# Altium schematic sheet robot_lfy.SchDoc
size A2
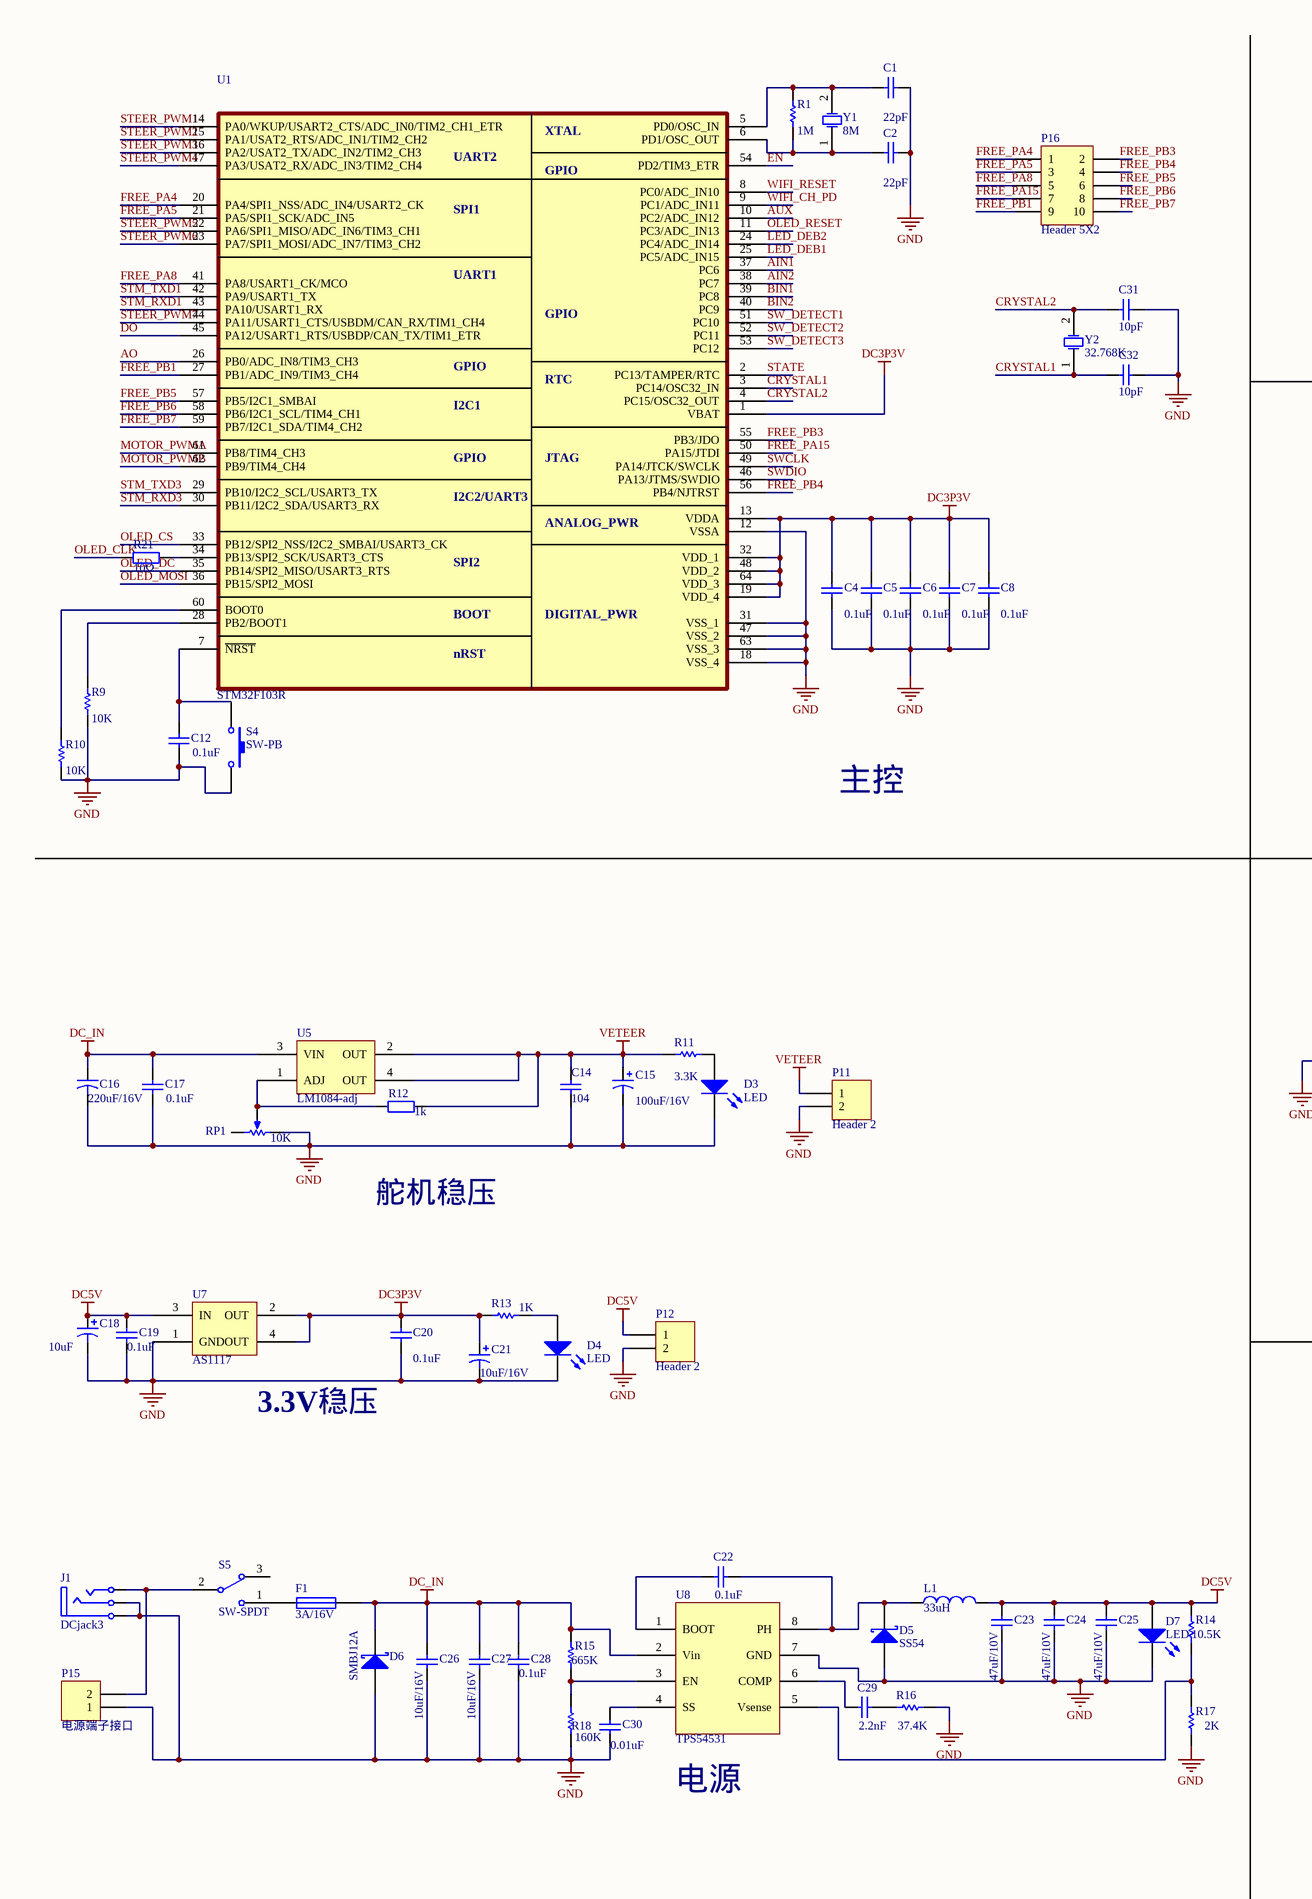
[diagram p0: robot_lfy.SchDoc, left]
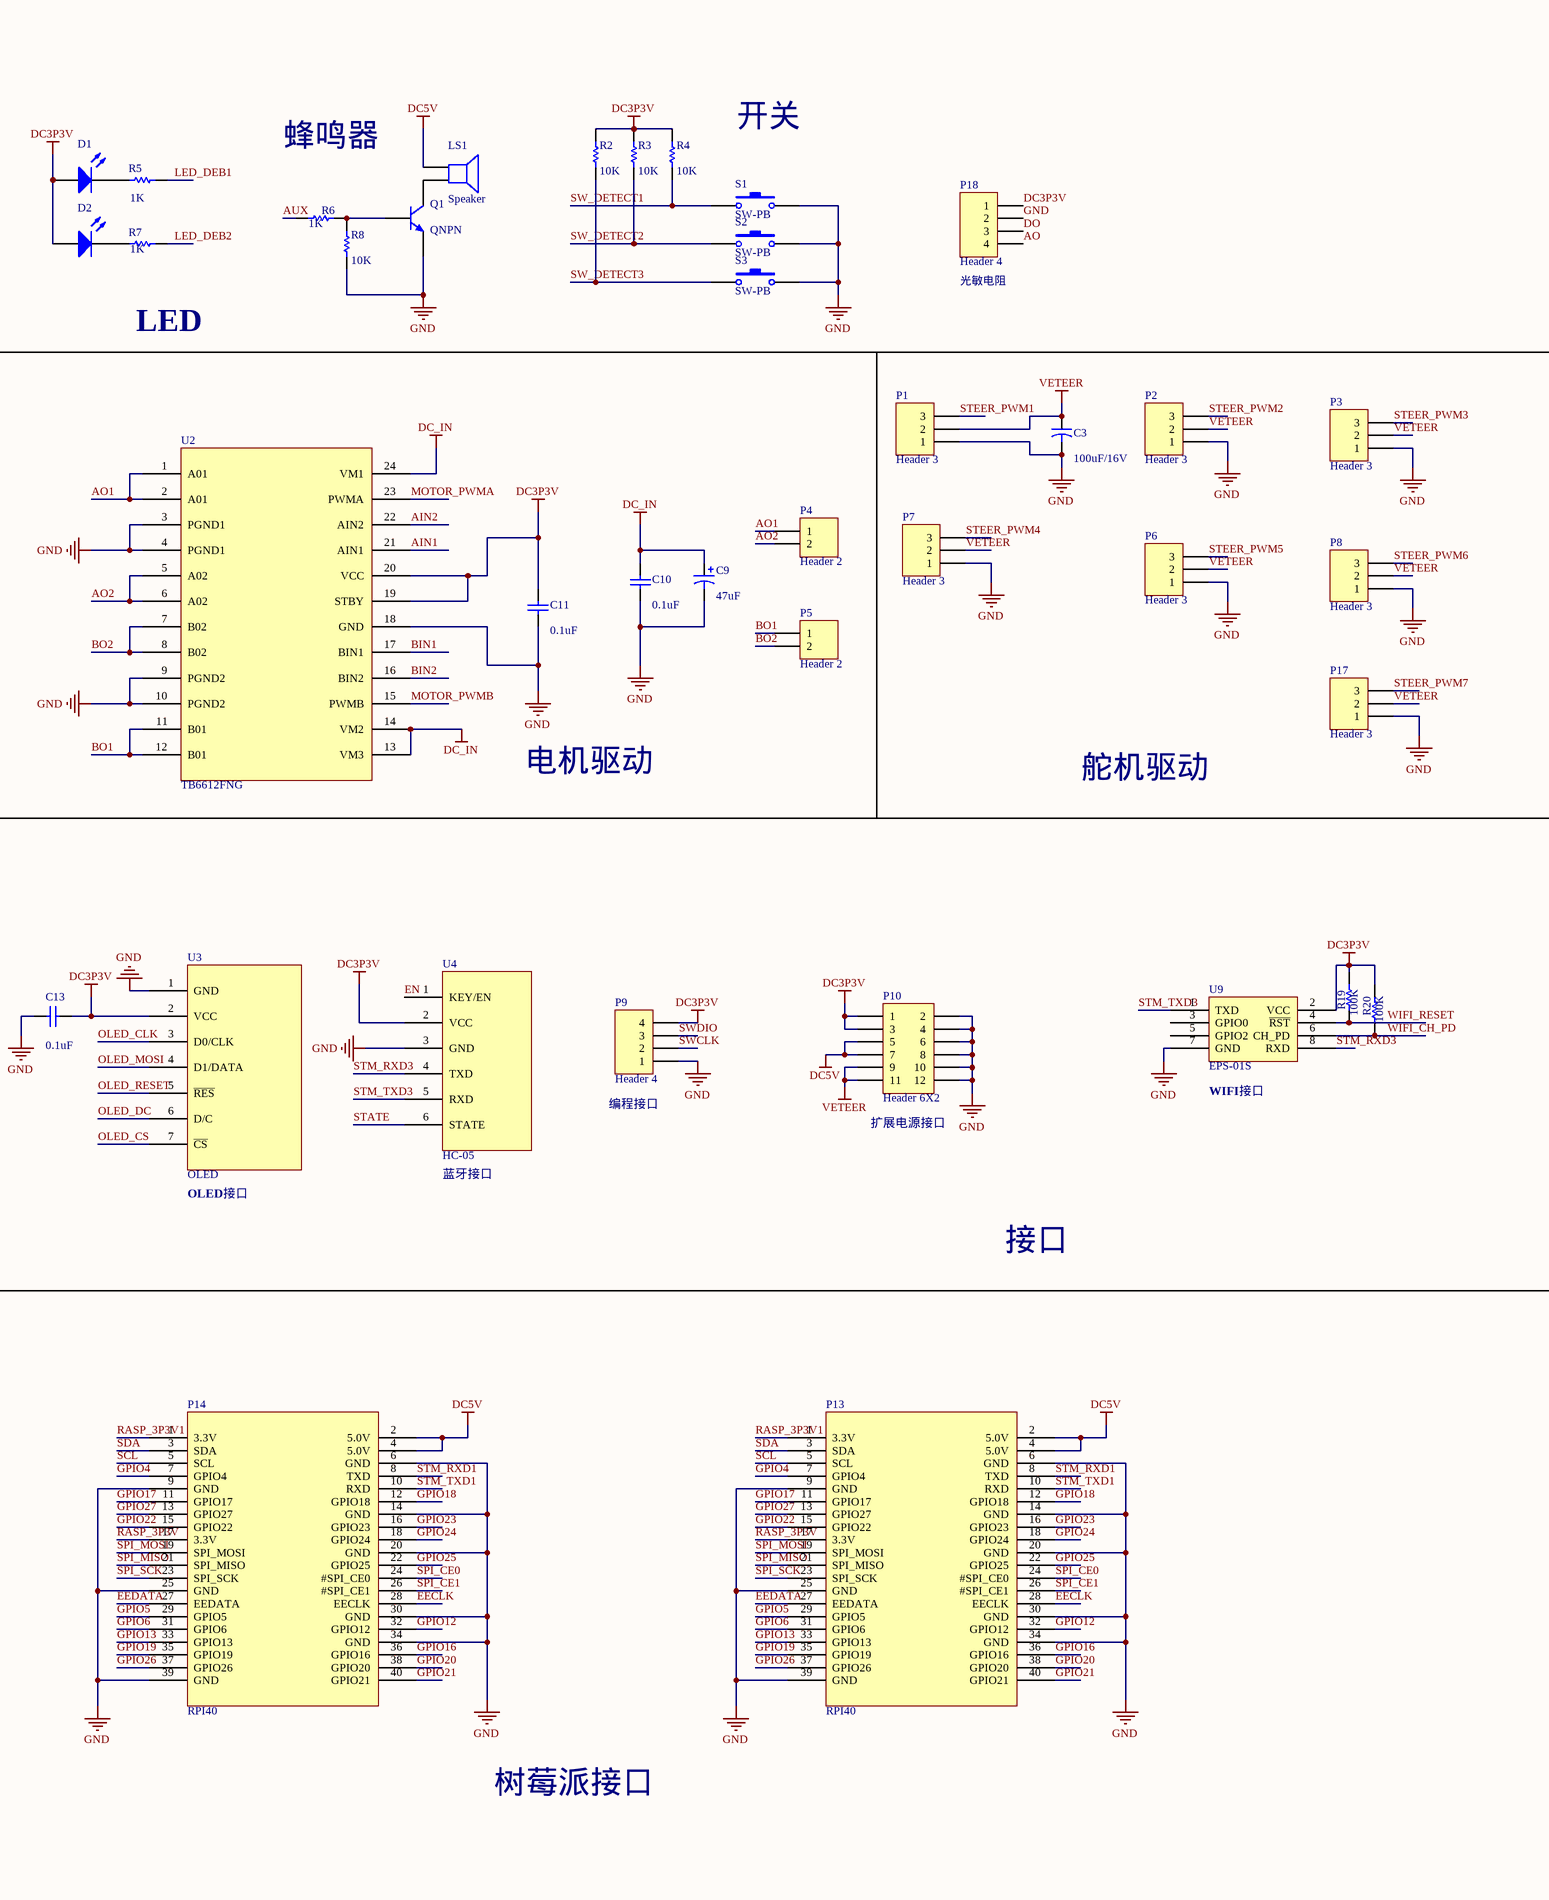
[diagram p1: robot_lfy.SchDoc, right]

## Parts
C1  value 22pF  [LC-0805_C]
C2  value 22pF  [LC-0805_C]
C3  value 100uF/16V  [CM D(6.3*7.7)]
C4  value 0.1uF  [LC-0805_C]
C5  value 0.1uF  [LC-0805_C]
C6  value 0.1uF  [LC-0805_C]
C7  value 0.1uF  [LC-0805_C]
C8  value 0.1uF  [LC-0805_C]
C9  value 47uF  [LC-1206_C]
C10  value 0.1uF  [LC-0805_C]
C11  value 0.1uF  [LC-0805_C]
C12  value 0.1uF  [LC-0805_C]
C13  value 0.1uF  [LC-0805_C]
C14  value 104  [LC-0805_C]
C15  value 100uF/16V  [CM D(6.3*7.7)]
C16  value 220uF/16V  [CM D(6.3*7.7)]
C17  value 0.1uF  [LC-0805_C]
C18  value 10uF  [LC-1206_C]
C19  value 0.1uF  [LC-0805_C]
C20  value 0.1uF  [LC-0805_C]
C21  value 10uF/16V  [LC-1206_C]
C22  value 0.1uF  [LC-0805_C]
C23  value 47uF/10V  [LC-1206_C]
C24  value 47uF/10V  [LC-1206_C]
C25  value 47uF/10V  [LC-1206_C]
C26  value 10uF/16V  [LC-0805_C]
C27  value 10uF/16V  [LC-0805_C]
C28  value 0.1uF  [LC-0805_C]
C29  value 2.2nF  [LC-0805_C]
C30  value 0.01uF  [LC-0805_C]
C31  value 10pF  [LC-0805_C]  (hidden comment: Cap)
C32  value 10pF  [LC-0805_C]  (hidden comment: Cap)
D1  (no value)  [LFY-0805_LED_S1]
D2  (no value)  [LFY-0805_LED_S1]
D3  LED  [LFY-0805_LED_S1]
D4  LED  [LFY-0805_LED_S1]
D5  SS54  [LFY-SMA(DO-214AC)S2]
D6  SMBJ12A  [LFY-SMA(DO-214AC)S2]
D7  LED  [LFY-0805_LED_S1]
F1  3A/16V  [LFY-1812_F]
J1  DCjack3  [HDC12]
L1  value 33uH  [LFY-SLO1040H]
LS1  Speaker  [BZ]
P1  Header 3  [HDR1X3]
P2  Header 3  [HDR1X3]
P3  Header 3  [HDR1X3]
P4  Header 2  [KF508-2P]
P5  Header 2  [KF508-2P]
P6  Header 3  [HDR1X3]
P7  Header 3  [HDR1X3]
P8  Header 3  [HDR1X3]
P9  Header 4  [HDR1X4]
P10  Header 6X2  [HDR2X6]
P11  Header 2  [KF508-2P]
P12  Header 2  [KF508-2P]
P13  RPI40  [HDR2X20]
P14  RPI40  [HDR2X20]
P15  电源端子接口  [KF508-2P]
P16  Header 5X2  [HDR2X5]
P17  Header 3  [HDR1X3]
P18  Header 4  [HDR1X4]
Q1  QNPN  [SOT-23B]
R1  value 1M  [LC-0805_R]
R2  value 10K  [LC-0805_R]
R3  value 10K  [LC-0805_R]
R4  value 10K  [LC-0805_R]
R5  value 1K  [LC-0805_R]
R6  value 1K  [LC-0805_R]
R7  value 1K  [LC-0805_R]
R8  value 10K  [LC-0805_R]
R9  value 10K  [LC-0805_R]
R10  value 10K  [LC-0805_R]
R11  value 3.3K  [LC-0805_R]
R12  value 1k  [LC-0805_R]
R13  value 1K  [LC-0805_R]
R14  value 10.5K  [LC-0805_R]
R15  value 665K  [LC-0805_R]
R16  value 37.4K  [LC-0805_R]
R17  value 2K  [LC-0805_R]
R18  value 160K  [LC-0805_R]
R19  value 100K  [LC-0805_R]
R20  value 100K  [LC-0805_R]
R21  value 10Ω  [LC-0805_R]  (hidden comment: Res2)
RP1  10K  [LFT-VR-3296]
S1  SW-PB  [SW-PB2]
S2  SW-PB  [SW-PB2]
S3  SW-PB  [SW-PB2]
S4  SW-PB  [SW-PB2]
S5  SW-SPDT  [LFY-SW-153D6-5]
U1  STM32F103R  [LFY-LQFP64-10*10]
U2  TB6612FNG  [LFY-SSOP24]
U3  OLED  [HDR1X7]
U4  HC-05
U5  LM1084-adj  [LFY-TO263-3]
U7  AS1117  [LFY-SOT223]
U8  TPS54531  [LFY-PDSO8]
U9  EPS-01S  [HDR2X4]
Y1  8M  [LC-HC-49S]
Y2  32.768K  [LFY-XTAL-8M]

## Nets
DC3P3V: C4.2 C5.2 C6.2 C7.2 C8.2 C11.2 C13.2 C20.2 C21.1 D1.1(A) D2.1(A) P9.4 P10.1 P10.3 P18.1 R2.2 R3.2 R4.2 R13.1 R19.1 R20.1 U1.1(VBAT) U1.13(VDDA) U1.19(VDD_4) U1.32(VDD_1) U1.48(VDD_2) U1.64(VDD_3) U2.19(STBY) U2.20(VCC) U3.2(VCC) U4.2(VCC) U7.2(OUT) U7.4(OUT) U9.2(VCC)
DC5V: C18.1 C19.2 C23.1 C24.1 C25.1 D7.1(A) L1.2 LS1.1 P10.5 P10.7 P12.1 P13.2(5.0V) P13.4(5.0V) P14.2(5.0V) P14.4(5.0V) R14.2 U7.3(IN)
DC_IN: C9.1 C10.2 C16.1 C17.2 C26.2 C27.2 C28.2 D6.2(K) F1.2 R15.2 U2.13(VM3) U2.14(VM2) U2.24(VM1) U5.3(VIN) U8.2(Vin)
GND: C1.2 C2.2 C3.2 C4.1 C5.1 C6.1 C7.1 C8.1 C9.2 C10.1 C11.1 C12.1 C13.1 C14.1 C15.2 C16.2 C17.1 C18.2 C19.1 C20.1 C21.2 C23.2 C24.2 C25.2 C26.1 C27.1 C28.1 C30.1 C31.1 C32.1 D3.2(K) D4.2(K) D5.1(A) D6.1(A) D7.2(K) J1.2(R) J1.3(S) P1.1 P2.1 P3.1 P6.1 P7.1 P8.1 P9.1 P10.2 P10.4 P10.6 P10.8 P10.10 P10.12 P11.2 P12.2 P13.6(GND) P13.9(GND) P13.14(GND) P13.20(GND) P13.25(GND) P13.30(GND) P13.34(GND) P13.39(GND) P14.6(GND) P14.9(GND) P14.14(GND) P14.20(GND) P14.25(GND) P14.30(GND) P14.34(GND) P14.39(GND) P15.1 P17.1 P18.2 Q1.2(E) R8.1 R9.1 R10.1 R16.1 R17.1 R18.1 RP1.1(TOP) S1.2 S2.2 S3.2 S4.2 U1.12(VSSA) U1.18(VSS_4) U1.31(VSS_1) U1.47(VSS_2) U1.63(VSS_3) U2.3(PGND1) U2.4(PGND1) U2.9(PGND2) U2.10(PGND2) U2.18(GND) U3.1(GND) U4.3(GND) U7.1(GND) U8.7(GND) U9.7(GND)
VETEER: C3.1 C14.2 C15.1 P1.2 P2.2 P3.2 P6.2 P7.2 P8.2 P10.9 P10.11 P11.1 P17.2 R11.1 R12.1 U5.2(OUT) U5.4(OUT)
AIN1: U1.37(PC6) U2.21(AIN1)
AIN2: U1.38(PC7) U2.22(AIN2)
AO: P18.4 U1.26(PB0/ADC_IN8/TIM3_CH3)
AO1: P4.1 U2.1(A01) U2.2(A01)
AO2: P4.2 U2.5(A02) U2.6(A02)
AUX: R6.1 U1.10(PC2/ADC_IN12)
BIN1: U1.39(PC8) U2.17(BIN1)
BIN2: U1.40(PC9) U2.16(BIN2)
BO1: P5.1 U2.11(B01) U2.12(B01)
BO2: P5.2 U2.7(B02) U2.8(B02)
CRYSTAL1: C32.2 U1.3(PC14/OSC32_IN) Y2.1(OSC1)
CRYSTAL2: C31.2 U1.4(PC15/OSC32_OUT) Y2.2(OSC2)
DO: P18.3 U1.45(PA12/USART1_RTS/USBDP/CAN_TX/TIM1_ETR)
EECLK: P13.28(EECLK) P14.28(EECLK)
EEDATA: P13.27(EEDATA) P14.27(EEDATA)
EN: U1.54(PD2/TIM3_ETR) U4.1(KEY/EN)
FREE_PA4: P16.1 U1.20(PA4/SPI1_NSS/ADC_IN4/USART2_CK)
FREE_PA5: P16.3 U1.21(PA5/SPI1_SCK/ADC_IN5)
FREE_PA8: P16.5 U1.41(PA8/USART1_CK/MCO)
FREE_PA15: P16.7 U1.50(PA15/JTDI)
FREE_PB1: P16.9 U1.27(PB1/ADC_IN9/TIM3_CH4)
FREE_PB3: P16.2 U1.55(PB3/JDO)
FREE_PB4: P16.4 U1.56(PB4/NJTRST)
FREE_PB5: P16.6 U1.57(PB5/I2C1_SMBAI)
FREE_PB6: P16.8 U1.58(PB6/I2C1_SCL/TIM4_CH1)
FREE_PB7: P16.10 U1.59(PB7/I2C1_SDA/TIM4_CH2)
GPIO4: P13.7(GPIO4) P14.7(GPIO4)
GPIO5: P13.29(GPIO5) P14.29(GPIO5)
GPIO6: P13.31(GPIO6) P14.31(GPIO6)
GPIO12: P13.32(GPIO12) P14.32(GPIO12)
GPIO13: P13.33(GPIO13) P14.33(GPIO13)
GPIO16: P13.36(GPIO16) P14.36(GPIO16)
GPIO17: P13.11(GPIO17) P14.11(GPIO17)
GPIO18: P13.12(GPIO18) P14.12(GPIO18)
GPIO19: P13.35(GPIO19) P14.35(GPIO19)
GPIO20: P13.38(GPIO20) P14.38(GPIO20)
GPIO21: P13.40(GPIO21) P14.40(GPIO21)
GPIO22: P13.15(GPIO22) P14.15(GPIO22)
GPIO23: P13.16(GPIO23) P14.16(GPIO23)
GPIO24: P13.18(GPIO24) P14.18(GPIO24)
GPIO25: P13.22(GPIO25) P14.22(GPIO25)
GPIO26: P13.37(GPIO26) P14.37(GPIO26)
GPIO27: P13.13(GPIO27) P14.13(GPIO27)
LED_DEB1: R5.2 U1.25(PC5/ADC_IN15)
LED_DEB2: R7.2 U1.24(PC4/ADC_IN14)
MOTOR_PWMA: U1.61(PB8/TIM4_CH3) U2.23(PWMA)
MOTOR_PWMB: U1.62(PB9/TIM4_CH4) U2.15(PWMB)
OLED_CLK: R21.2 U3.3(D0/CLK)
OLED_CS: U1.33(PB12/SPI2_NSS/I2C2_SMBAI/USART3_CK) U3.7(~{CS})
OLED_DC: U1.35(PB14/SPI2_MISO/USART3_RTS) U3.6(D/C)
OLED_MOSI: U1.36(PB15/SPI2_MOSI) U3.4(D1/DATA)
OLED_RESET: U1.11(PC3/ADC_IN13) U3.5(~{RES})
RASP_3P3V: P13.17(3.3V) P14.17(3.3V)
RASP_3P3V1: P13.1(3.3V) P14.1(3.3V)
SCL: P13.5(SCL) P14.5(SCL)
SDA: P13.3(SDA) P14.3(SDA)
SPI_CE0: P13.24(#SPI_CE0) P14.24(#SPI_CE0)
SPI_CE1: P13.26(#SPI_CE1) P14.26(#SPI_CE1)
SPI_MISO: P13.21(SPI_MISO) P14.21(SPI_MISO)
SPI_MOSI: P13.19(SPI_MOSI) P14.19(SPI_MOSI)
SPI_SCK: P13.23(SPI_SCK) P14.23(SPI_SCK)
STATE: U1.2(PC13/TAMPER/RTC) U4.6(STATE)
STEER_PWM1: P1.3 U1.14(PA0/WKUP/USART2_CTS/ADC_IN0/TIM2_CH1_ETR)
STEER_PWM2: P2.3 U1.15(PA1/USAT2_RTS/ADC_IN1/TIM2_CH2)
STEER_PWM3: P3.3 U1.16(PA2/USAT2_TX/ADC_IN2/TIM2_CH3)
STEER_PWM4: P7.3 U1.17(PA3/USAT2_RX/ADC_IN3/TIM2_CH4)
STEER_PWM5: P6.3 U1.22(PA6/SPI1_MISO/ADC_IN6/TIM3_CH1)
STEER_PWM6: P8.3 U1.23(PA7/SPI1_MOSI/ADC_IN7/TIM3_CH2)
STEER_PWM7: P17.3 U1.44(PA11/USART1_CTS/USBDM/CAN_RX/TIM1_CH4)
STM_RXD1: P13.8(TXD) P14.8(TXD) U1.43(PA10/USART1_RX)
STM_RXD3: U1.30(PB11/I2C2_SDA/USART3_RX) U4.4(TXD) U9.8(RXD)
STM_TXD1: P13.10(RXD) P14.10(RXD) U1.42(PA9/USART1_TX)
STM_TXD3: U1.29(PB10/I2C2_SCL/USART3_TX) U4.5(RXD) U9.1(TXD)
SW_DETECT1: R4.1 S1.1 U1.51(PC10)
SW_DETECT2: R3.1 S2.1 U1.52(PC11)
SW_DETECT3: R2.1 S3.1 U1.53(PC12)
SWCLK: P9.2 U1.49(PA14/JTCK/SWCLK)
SWDIO: P9.3 U1.46(PA13/JTMS/SWDIO)
WIFI_CH_PD: R20.2 U1.9(PC1/ADC_IN11) U9.6(CH_PD)
WIFI_RESET: R19.2 U1.8(PC0/ADC_IN10) U9.4(~{RST})
NetC1_1: C1.1 R1.2 U1.5(PD0/OSC_IN) Y1.2(OSC2)
NetC2_1: C2.1 R1.1 U1.6(PD1/OSC_OUT) Y1.1(OSC1)
NetC12_2: C12.2 S4.1 U1.7(~{NRST})
NetC22_1: C22.1 D5.2(K) L1.1 U8.8(PH)
NetC22_2: C22.2 U8.1(BOOT)
NetC29_1: C29.1 R16.2
NetC29_2: C29.2 U8.6(COMP)
NetC30_2: C30.2 U8.4(SS)
NetD1_2: D1.2(K) R5.1
NetD2_2: D2.2(K) R7.1
NetD3_1: D3.1(A) R11.2
NetD4_1: D4.1(A) R13.2
NetF1_1: F1.1 S5.1
NetJ1_1: J1.1(T) P15.2 S5.2
NetLS1_2: LS1.2 Q1.3(C)
NetQ1_1: Q1.1(B) R6.2 R8.2
NetR9_2: R9.2 U1.28(PB2/BOOT1)
NetR10_2: R10.2 U1.60(BOOT0)
NetR12_2: R12.2 RP1.2(TAP) U5.1(ADJ)
NetR14_1: R14.1 R17.2 U8.5(Vsense)
NetR15_1: R15.1 R18.2 U8.3(EN)
NetR21_1: R21.1 U1.34(PB13/SPI2_SCK/USART3_CTS)

Not connected (* = marked no-connect by the designer): RP1 3(BOT); S5 3; U9 3(GPIO0) 5(GPIO2)

## Notes on the sheet
- 蜂鸣器
- 开关
- LED
- (near P18) 光敏电阻
- 主控
- 电机驱动
- 舵机驱动
- (near P9) 编程接口
- (near U9) WIFI接口
- 舵机稳压
- (near P10) 扩展电源接口
- (near U3) OLED接口
- (near U4) 蓝牙接口
- 接口
- 3.3V稳压
- 电源
- 树莓派接口
- (in symbol STM32F103R) XTAL; UART2; GPIO; SPI1; UART1; RTC; I2C1; JTAG; I2C2/UART3; ANALOG_PWR; SPI2; BOOT; DIGITAL_PWR; nRST

## Library data of the parts
C1 C2 C4-C8 C10-C14 C17 C19 C20 C22-C32 = Cap: Capacitor; Published: 8-Jun-2000; LatestRevisionDate: 17-Jul-2002; LatestRevisionNote: Re-released for DXP Platform.; PackageReference: RAD-0.3; Publisher: Altium Limited
  C19 C20 C31 C32: PackageDescription: Radial Cap, Thru-Hole; 2 Leads; 0.3 in Pin Spacing
C3 C16 = Cap2: Capacitor; Published: 23-Sep-2002; PackageReference: CAPR5-4X5; Publisher: Altium Limited
C9 = Cap Pol3: Polarized Capacitor (Surface Mount); Published: 8-Jun-2000; LatestRevisionDate: 17-Jul-2002; LatestRevisionNote: Re-released for DXP Platform.; PackageReference: C0805; Publisher: Altium Limited
C15 C18 C21 = Cap Pol1: Polarized Capacitor (Radial); Published: 8-Jun-2000; LatestRevisionDate: 17-Jul-2002; LatestRevisionNote: Re-released for DXP Platform.; PackageReference: RB7.6-15; Publisher: Altium Limited
D1 D2 = LED0: Typical INFRARED GaAs LED; Published: 8-Jun-2000; LatestRevisionDate: 08-Jul-2005; LatestRevisionNote: Mech Layer 1 removed.; PackageReference: LED-0; Publisher: Altium Limited
D3 D4 D7 = LED2: Typical RED, GREEN, YELLOW, AMBER GaAs LED; Published: 8-Jun-2000; LatestRevisionDate: 17-Jul-2002; LatestRevisionNote: Re-released for DXP Platform.; PackageDocument: Feb-2002; PackageReference: 3.2X1.6X1.1; Publisher: Altium Limited
D5 D6 = D Schottky: Schottky Diode; Published: 8-Jun-2000; LatestRevisionDate: 17-Jul-2002; LatestRevisionNote: Re-released for DXP Platform.; PackageReference: SMB; Publisher: Altium Limited; Code_JEDEC: DO-214-AA
F1 = Fuse 1: Fuse; Published: 8-Jun-2000; LatestRevisionDate: 17-Jul-2002; LatestRevisionNote: Re-released for DXP Platform.; PackageReference: PIN-W2/E2.8; Publisher: Altium Limited
J1 = Phonejack3: Jack Socket, 1/4" [6.5mm], Thru-Hole, Vertical, 3-Conductor Open Circuit (Non-Normalling); PackageDocument: 2003; PCB_Layout: Complies with manufacturer's recommendation.; DrillAndSlotSize: Corresponds to nominal value.; Published: 15-Jul-2004; LatestRevisionDate: 15-Jul-2004; LatestRevisionNote: Component Replaced.; DatasheetDocument: 2003; PackageReference: S1VS_SSS; Publisher: Altium Limited; ComponentLink1Description: Manufacturer Link; ComponentLink1URL: http://www.cliffuk.co.uk/
L1 = Inductor: Code_IEC: 1005; Published: 8-Jun-2000; LatestRevisionDate: 17-Jul-2002; LatestRevisionNote: Re-released for DXP Platform.; PackageReference: 0402-A; Publisher: Altium Limited; Code_JEITA: 0402
LS1 = Speaker: Loudspeaker; Published: 24-Mar-1999; LatestRevisionDate: 17-Jul-2002; LatestRevisionNote: Re-released for DXP Platform.; PackageReference: PIN2; Publisher: Altium Limited
P1-P3 P6-P8 P17 = Header 3: Header, 3-Pin; LatestRevisionDate: 17-Jul-2002; LatestRevisionNote: Re-released for DXP Platform.; Publisher: Altium Limited
P4 P5 P11 P12 P15 = Header 2: Header, 2-Pin; LatestRevisionDate: 17-Jul-2002; LatestRevisionNote: Re-released for DXP Platform.; Publisher: Altium Limited
P9 P18 = Header 4: Header, 4-Pin; LatestRevisionDate: 17-Jul-2002; LatestRevisionNote: Re-released for DXP Platform.; Publisher: Altium Limited
P10 = Header 6X2: Header, 6-Pin, Dual row; LatestRevisionDate: 17-Jul-2002; LatestRevisionNote: Re-released for DXP Platform.; Publisher: Altium Limited
P16 = Header 5X2: Header, 5-Pin, Dual row; LatestRevisionDate: 17-Jul-2002; LatestRevisionNote: Re-released for DXP Platform.; Publisher: Altium Limited
Q1 = QNPN: NPN Bipolar Transistor; Published: 8-Jun-2000; LatestRevisionDate: 17-Jul-2002; LatestRevisionNote: Re-released for DXP Platform.; PackageReference: SOT-23B; Publisher: Altium Limited; Code_JEDEC: SOT-23
R1-R11 R13-R20 = Res1: Resistor; Published: 8-Jun-2000; LatestRevisionDate: 17-Jul-2002; LatestRevisionNote: Re-released for DXP Platform.; PackageReference: AXIAL-0.3; Publisher: Altium Limited
R12 R21 = Res2: Resistor; Published: 8-Jun-2000; LatestRevisionDate: 17-Jul-2002; LatestRevisionNote: Re-released for DXP Platform.; PackageReference: AXIAL-0.4; Publisher: Altium Limited
RP1 = 3296W电位器
S1-S3 = SW-PB: Switch; Published: 24-Mar-1999; LatestRevisionDate: 17-Jul-2002; LatestRevisionNote: Re-released for DXP Platform.; PackageReference: SPST-2; Publisher: Altium Limited
S4 = SW-PB: 微动开关; Published: 24-Mar-1999; LatestRevisionDate: 17-Jul-2002; LatestRevisionNote: Re-released for DXP Platform.; PackageReference: SPST-2; Publisher: Altium Limited
S5 = SW-SPDT: SPDT Subminiature Toggle Switch, Right Angle Mounting, Vertical Actuation; Published: 24-Mar-1999; LatestRevisionDate: 17-Dec-2003; LatestRevisionNote: Schematic revised, PCB Footprint replaced.; DatasheetDocument: 05-Dec-2000; PackageReference: TL36WW15050; Publisher: Altium Limited; ComponentLink1Description: Manufacturer Link; ComponentLink1URL: http://www.apem.com
U7 = REG1117-3.3
U9 = EPS-0IS
Y1 Y2 = XTAL: Crystal Oscillator; Published: 8-Jun-2000; LatestRevisionDate: 17-Jul-2002; LatestRevisionNote: Re-released for DXP Platform.; PackageReference: R38
  Y1: Publisher: 8M
  Y2: Publisher: Altium Limited; PackageDescription: Crystal, Thru-Hole; 2 Leads; Body 3.1 x 8.2 mm (Dia.xH)